# EAGLE design Second try (EAGLE 9.6.2)
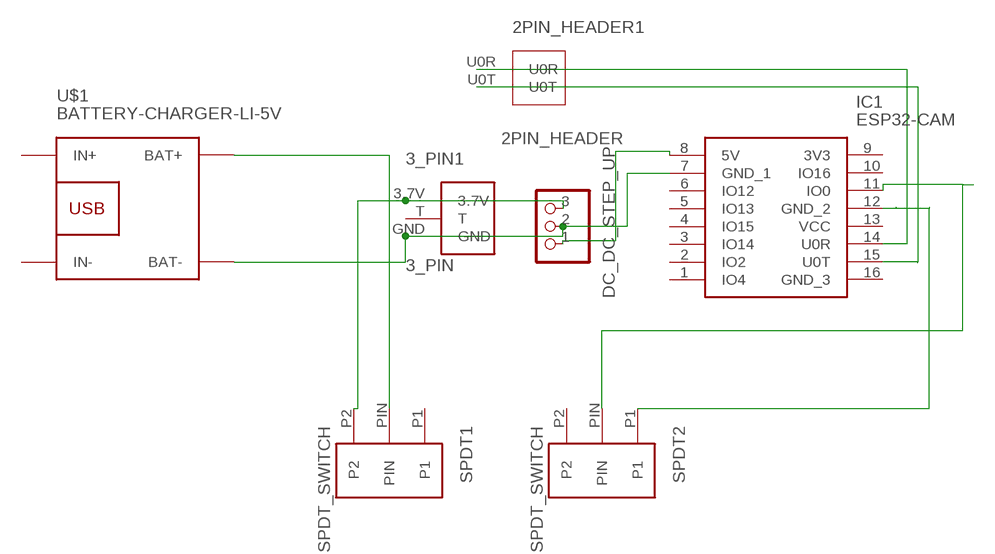
[diagram p0: schematic, sheet 1]

## Parts
2PIN_HEADER1  2PIN_HEADER  [2PIN_HEADER]
3_PIN1  3_PIN  [3_PIN]
DC_DC_STEP_UP  PINHD-1X3  [1X03]
IC1  ESP32-CAM  [ESP32CAM]
SPDT1  SPDT_SWITCH  [SPDT_SWITCH]
SPDT2  SPDT_SWITCH  [SPDT_SWITCH]
U$1  BATTERY-CHARGER-LI-5V  [BATTERY-CHARGER-LI-5V]

## Nets
N$1: 3_PIN1.GND DC_DC_STEP_UP.2 IC1.7(GND_1) U$1.BAT-
N$2: 3_PIN1.3.7V DC_DC_STEP_UP.3 SPDT1.P2
N$3: SPDT1.PIN U$1.BAT+
N$4: DC_DC_STEP_UP.1 IC1.8(5V)
N$5: IC1.11(IO0) SPDT2.PIN
N$6: IC1.12(GND_2) SPDT2.P1
N$8: 2PIN_HEADER1.U0R IC1.14(U0R)
N$9: 2PIN_HEADER1.U0T IC1.15(U0T)
Unconnected: 3_PIN1.T IC1.1(IO4) IC1.2(IO2) IC1.3(IO14) IC1.4(IO15) IC1.5(IO13) IC1.6(IO12) IC1.9(3V3) IC1.10(IO16) IC1.13(VCC) IC1.16(GND_3) SPDT1.P1 SPDT2.P2 U$1.IN+ U$1.IN-

## Library data of the parts
2PIN_HEADER1 = 2pin_HEADER:2PIN_HEADER
3_PIN1 = 3_pin:3_PIN
DC_DC_STEP_UP = pinhead:PINHD-1X3: PIN HEADER
IC1 = ESP32-CAM:ESP32-CAM: Modules PCBA Module RoHS Source: Datasheet <https://datasheet.lcsc.com/szlcsc/Ai-Thinker-ESP32-CAM_C277946.pdf>; DESCRIPTION: Modules PCBA Module RoHS; HEIGHT: 5mm; MANUFACTURER_NAME: Ai-Thinker; MANUFACTURER_PART_NUMBER: ESP32-CAM
SPDT1 SPDT2 = SPDT_SWITCH:SPDT_SWITCH
U$1 = diy-modules:BATTERY-CHARGER-LI-5V: Lithium Battery 5V Charger More details available here: http://www.buildcircuit.com/how-to-use-micro-usb-5v-1a-lithium-battery-charging-board-charger-module/ Click here to find device on ebay.com <http://www.ebay.com/sch/tp4056+charger+usb>

## Board
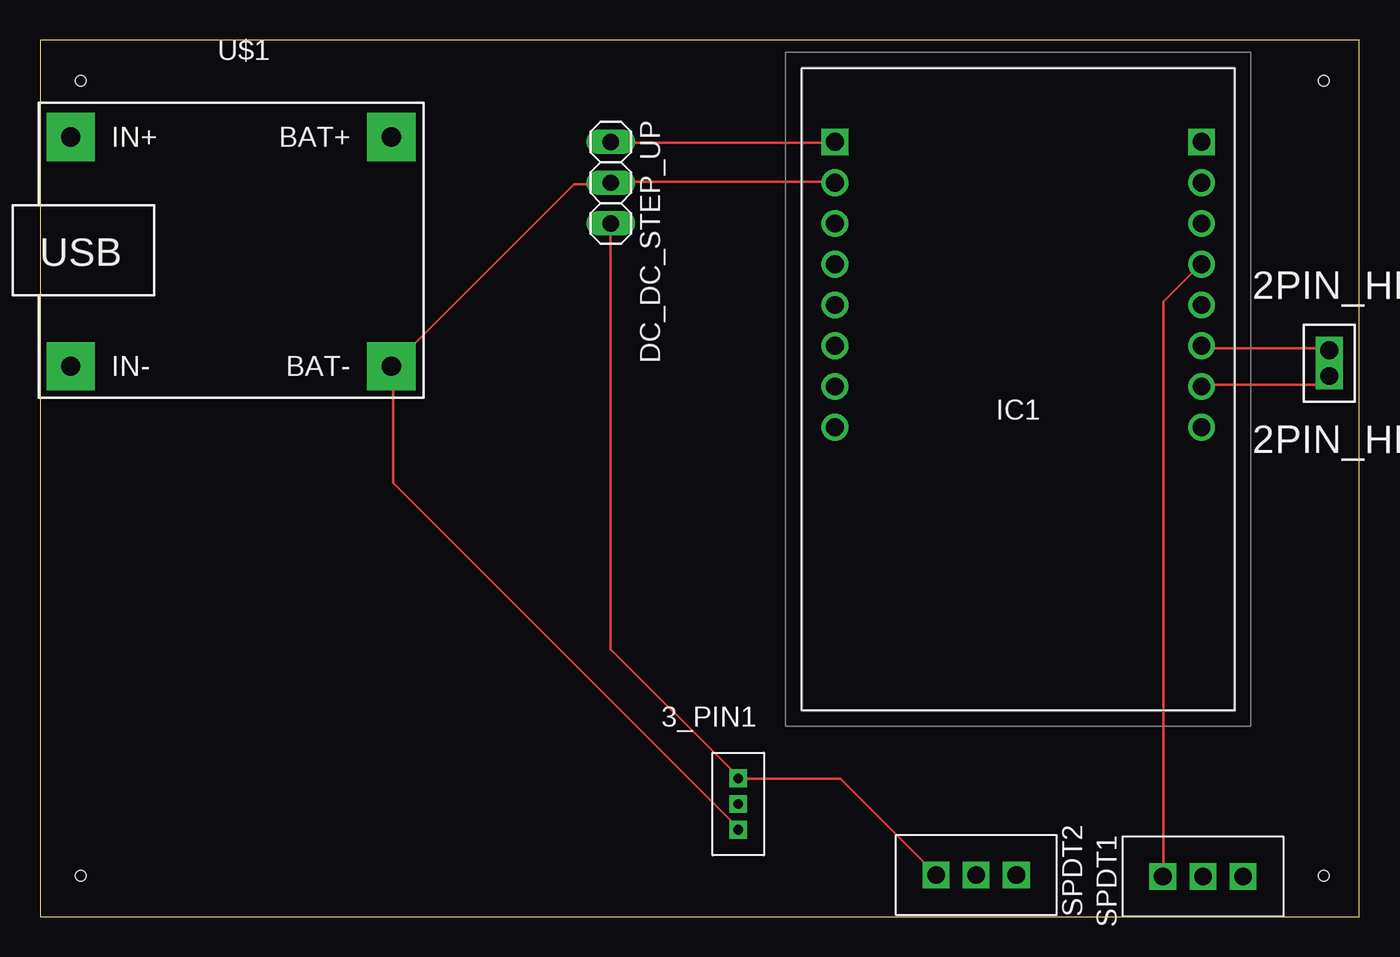
[diagram p1: board, top side]
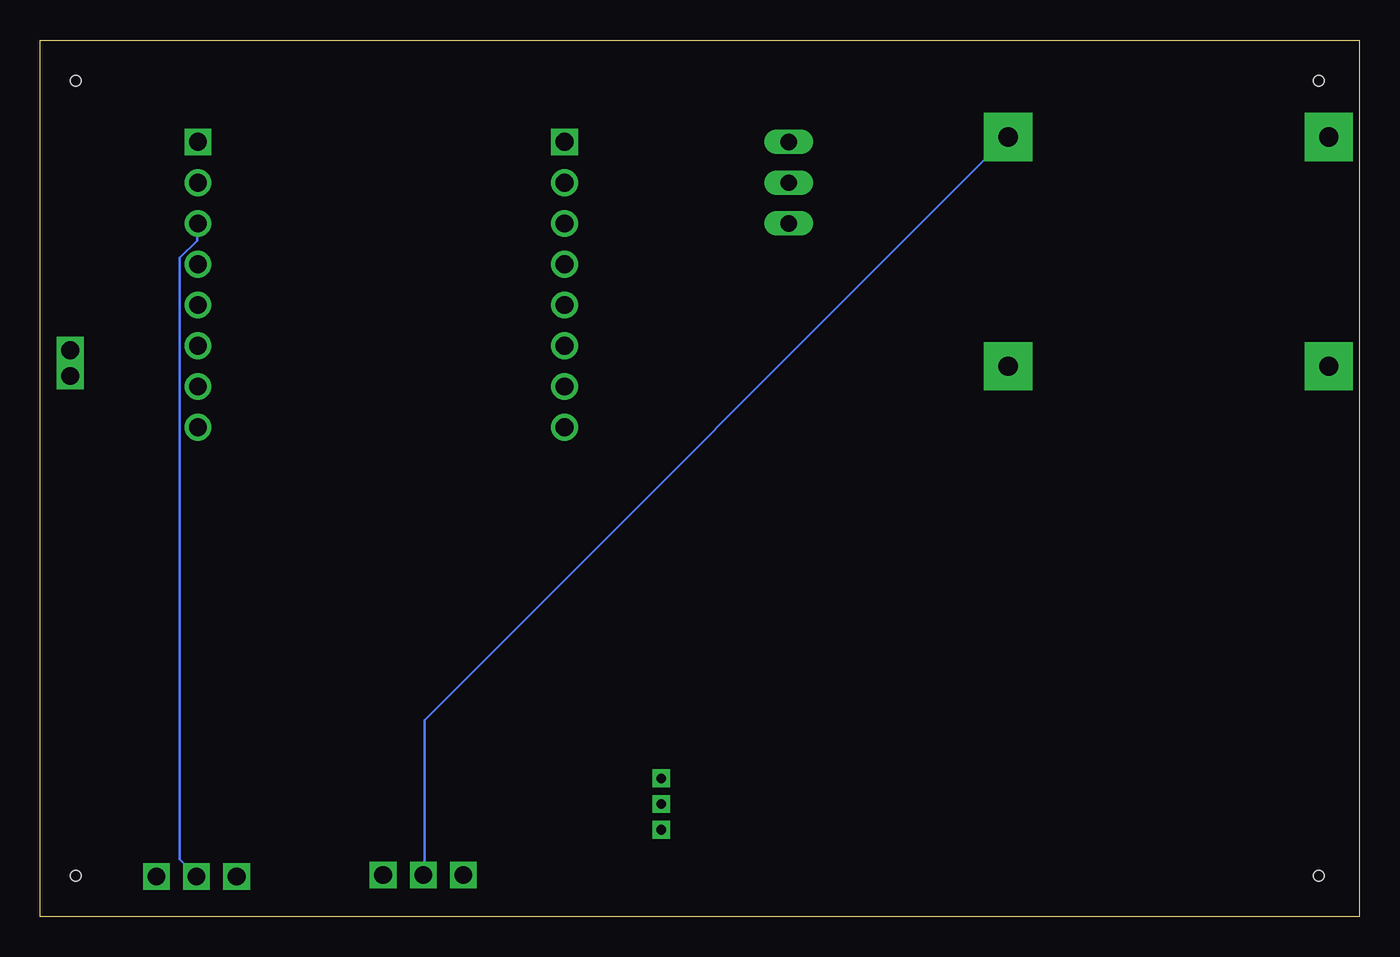
[diagram p2: board, bottom side, seen from below]

Size 82.22 x 54.6 mm. Coordinates in mm from the lower left corner, seen from the top.
Outline: 0,0 82.22,0 82.22,54.6 0,54.6 0,0
Copper layers (1*16): Top 0.035mm / dielectric 1.5mm / Bottom 0.035mm
Design rules "default": minimum track width 6mil, minimum drill 0.35mm, track to track 6mil, track to pad 6mil, pad to pad 6mil, via to via 6mil, smd to smd 6mil, copper to edge 40mil, drill to drill 6mil, minimum pad ring 10mil, minimum via ring 8mil, stop-mask expansion 4mil, vias tented up to drill 0mil, thermal gap 10mil
Holes 0.65 mm at 2.54,52.07 2.54,2.54 80.01,2.54 80.01,52.07

### Footprints (pad centres in the part's own frame; a part is rotated, then mirrored left to right if it is on the bottom)
2PIN_HEADER = drill 1.1 pad 1.665 square: U0R 1.6,4.8; U0T 1.6,3.2
3_PIN = drill 0.6 square: 3.7V 1.6,4.8; GND 1.6,1.6; T 1.6,3.2
1X03 = drill 1.016 long: 1 -2.54,0; 2 0,0; 3 2.54,0
ESP32CAM = drill 1.11 pad 1.665: 1 0,0; 2 0,2.54; 3 0,5.08; 4 0,7.62; 5 0,10.16; 6 0,12.7; 7 0,15.24; 10 22.86,15.24; 11 22.86,12.7; 12 22.86,10.16; 13 22.86,7.62; 14 22.86,5.08; 15 22.86,2.54; 16 22.86,0 | drill 1.11 pad 1.665 square: 8 0,17.78; 9 22.86,17.78
SPDT_SWITCH = drill 1.1 pad 1.665 square: P1 2.5,7.5; P2 2.5,2.5; PIN 2.5,5
BATTERY-CHARGER-LI-5V = drill 1.2 pad 3 square: BAT+ 9.195,6.655; BAT- 9.195,-7.62; IN+ -10.795,6.655; IN- -10.795,-7.62

### Placement (x,y rotation side)
2PIN_HEADER1  78.74,30.48 0 top
3_PIN1  41.91,3.81 0 top
DC_DC_STEP_UP  35.56,45.72 270 top
IC1  49.53,30.48 0 top
SPDT1  53.34,5.08 270 top
SPDT2  77.47,0 90 top
U$1  12.7,41.91 0 top

### Tracks (layer width: path | path; a pad name or v marks a point on that pad's centre or on a via)
N$1
  Top 0.152: IC1.7 49.43,45.77 35.56,45.77 DC_DC_STEP_UP.2 35.56,45.62 33.27,45.62 22,34.34 U$1.BAT- 22,34.19 22,27.03 43.49,5.54 3_PIN1.GND
N$2
  Top 0.152: SPDT1.P2 55.83,2.64 49.89,8.59 43.64,8.59 3_PIN1.3.7V 43.49,8.74 35.56,16.66 DC_DC_STEP_UP.3
N$3
  Bottom 0.152: SPDT1.PIN 58.27,2.64 58.27,12.24 22,48.51 U$1.BAT+
N$4
  Top 0.152: DC_DC_STEP_UP.1 35.56,48.21 49.43,48.21 IC1.8
N$5
  Bottom 0.152: IC1.11 72.44,43.18 72.44,42.11 73.51,41.05 73.51,3.56 72.59,2.64 SPDT2.PIN
N$6
  Top 0.152: SPDT2.P1 70,2.64 70,38.3 72.29,40.59 IC1.12
N$8
  Top 0.152: 2PIN_HEADER1.U0R 80.21,35.41 72.59,35.41 72.44,35.56 IC1.14
N$9
  Top 0.152: IC1.15 72.44,33.12 79.76,33.12 80.21,33.58 2PIN_HEADER1.U0T